# Altium project NEP.PRJPCB
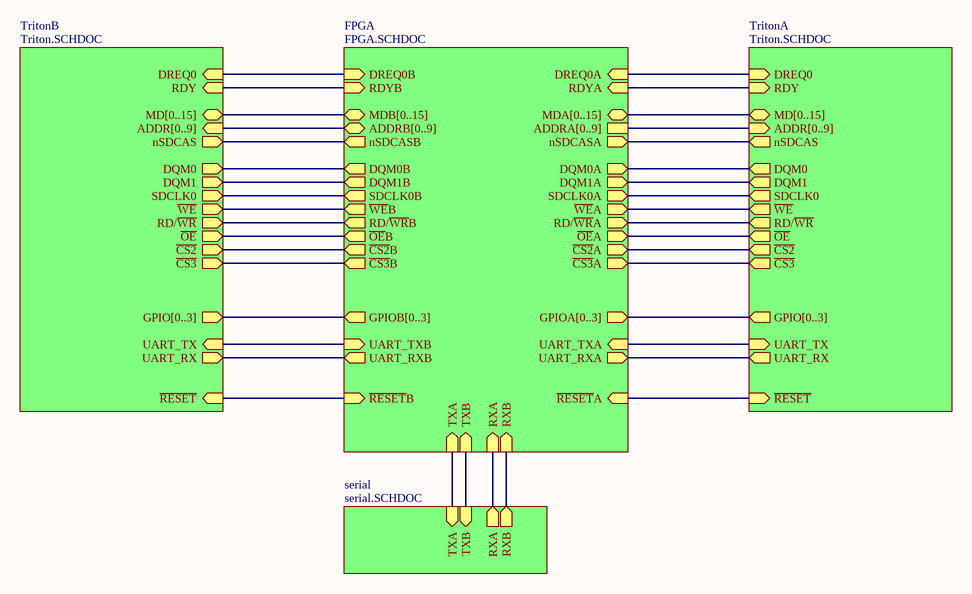
[diagram p0: main.SCHDOC]
5 sheets, 68 parts. Net scope: hierarchical (ports join the sheet entries above them; power ports are global).
Board file: NEP.PCBDOC
Sheets:
  main.SCHDOC
    FPGA = FPGA.SCHDOC
    TritonA = Triton.SCHDOC
    TritonB = Triton.SCHDOC
    serial = serial.SCHDOC
  powerclocks.SCHDOC

## Sheet main.SCHDOC
size B

### Sub-sheets
FPGA = FPGA.SCHDOC: DQM0A (out), DQM1A (out), SDCLK0A (out), DREQ0A (in), RDYA (in), ~{WE}A (out), RD/~{WR}A (out), ~{OE}A (out), ~{CS2}A (out), ~{CS3}A (out), nSDCASA (out), ADDRA[0..9], MDA[0..15] (bidir), ~{RESET}A (in), GPIOA[0..3] (out), UART_RXA (out), UART_TXA (in), RDYB (in), ~{WE}B (out), RD/~{WR}B (out), ~{OE}B (out), ~{CS2}B (out), ~{CS3}B (out), nSDCASB (out), SDCLK0B (out), DQM0B (out), DQM1B (out), DREQ0B (in), ~{RESET}B (in), GPIOB[0..3] (out), UART_RXB (out), UART_TXB (in), MDB[0..15] (bidir), ADDRB[0..9] (bidir), TXA (in), TXB (in), RXA (in), RXB (in)
serial = serial.SCHDOC: TXA (in), TXB (in), RXA (out), RXB (out)
TritonA = Triton.SCHDOC: ~{RESET} (in), DQM0 (out), DQM1 (out), SDCLK0 (out), DREQ0 (in), RDY (in), ~{WE} (out), RD/~{WR} (out), ~{OE} (out), ~{CS2} (out), ~{CS3} (out), nSDCAS (out), GPIO[0..3] (out), UART_RX (out), UART_TX (in), MD[0..15] (bidir), ADDR[0..9] (in)
TritonB = Triton.SCHDOC: ~{RESET} (in), DQM0 (out), DQM1 (out), SDCLK0 (out), DREQ0 (in), RDY (in), ~{WE} (out), RD/~{WR} (out), ~{OE} (out), ~{CS2} (out), ~{CS3} (out), nSDCAS (out), GPIO[0..3] (out), UART_RX (out), UART_TX (in), MD[0..15] (bidir), ADDR[0..9] (in)

### Nets
NetU1_18: sheet FPGA/nSDCASA, sheet TritonA/nSDCAS
NetU1_19: sheet FPGA/~{CS3}A, sheet TritonA/~{CS3}
NetU1_20: sheet FPGA/~{CS2}A, sheet TritonA/~{CS2}
NetU1_21: sheet FPGA/RDYA, sheet TritonA/RDY
NetU1_22: sheet FPGA/~{WE}A, sheet TritonA/~{WE}
NetU1_24: sheet FPGA/RD/~{WR}A, sheet TritonA/RD/~{WR}
NetU1_26: sheet FPGA/~{OE}A, sheet TritonA/~{OE}
NetU1_28: sheet FPGA/RXB, sheet serial/RXB
NetU1_65: sheet FPGA/DREQ0A, sheet TritonA/DREQ0
NetU1_67: sheet FPGA/UART_RXA, sheet TritonA/UART_RX
NetU1_68: sheet FPGA/UART_TXA, sheet TritonA/UART_TX
NetU1_71: sheet FPGA/~{RESET}A, sheet TritonA/~{RESET}
NetU1_72: sheet FPGA/DQM1A, sheet TritonA/DQM1
NetU1_74: sheet FPGA/DQM0A, sheet TritonA/DQM0
NetU1_76: sheet FPGA/TXB, sheet serial/TXB
NetU1_77: sheet FPGA/SDCLK0A, sheet TritonA/SDCLK0
NetU1_78: sheet FPGA/RXA, sheet serial/RXA
NetU1_79: sheet FPGA/TXA, sheet serial/TXA
NetU1_80: sheet FPGA/SDCLK0B, sheet TritonB/SDCLK0
NetU1_102: sheet FPGA/nSDCASB, sheet TritonB/nSDCAS
NetU1_108: sheet FPGA/~{CS2}B, sheet TritonB/~{CS2}
NetU1_109: sheet FPGA/~{CS3}B, sheet TritonB/~{CS3}
NetU1_111: sheet FPGA/~{OE}B, sheet TritonB/~{OE}
NetU1_113: sheet FPGA/RD/~{WR}B, sheet TritonB/RD/~{WR}
NetU1_114: sheet FPGA/~{WE}B, sheet TritonB/~{WE}
NetU1_115: sheet FPGA/RDYB, sheet TritonB/RDY
NetU1_143: sheet FPGA/DREQ0B, sheet TritonB/DREQ0
NetU1_144: sheet FPGA/UART_TXB, sheet TritonB/UART_TX
NetU1_146: sheet FPGA/UART_RXB, sheet TritonB/UART_RX
NetU1_147: sheet FPGA/~{RESET}B, sheet TritonB/~{RESET}
NetU1_148: sheet FPGA/DQM1B, sheet TritonB/DQM1
NetU1_149: sheet FPGA/DQM0B, sheet TritonB/DQM0

### Buses and harness runs
bus sheet FPGA/ADDRA[0..9] = sheet TritonA/ADDR[0..9]
bus sheet FPGA/ADDRB[0..9] = sheet TritonB/ADDR[0..9]
bus sheet FPGA/GPIOA[0..3] = sheet TritonA/GPIO[0..3]
bus sheet FPGA/GPIOB[0..3] = sheet TritonB/GPIO[0..3]
bus sheet FPGA/MDA[0..15] = sheet TritonA/MD[0..15]
bus sheet FPGA/MDB[0..15] = sheet TritonB/MD[0..15]

## Sheet FPGA.SCHDOC
size B
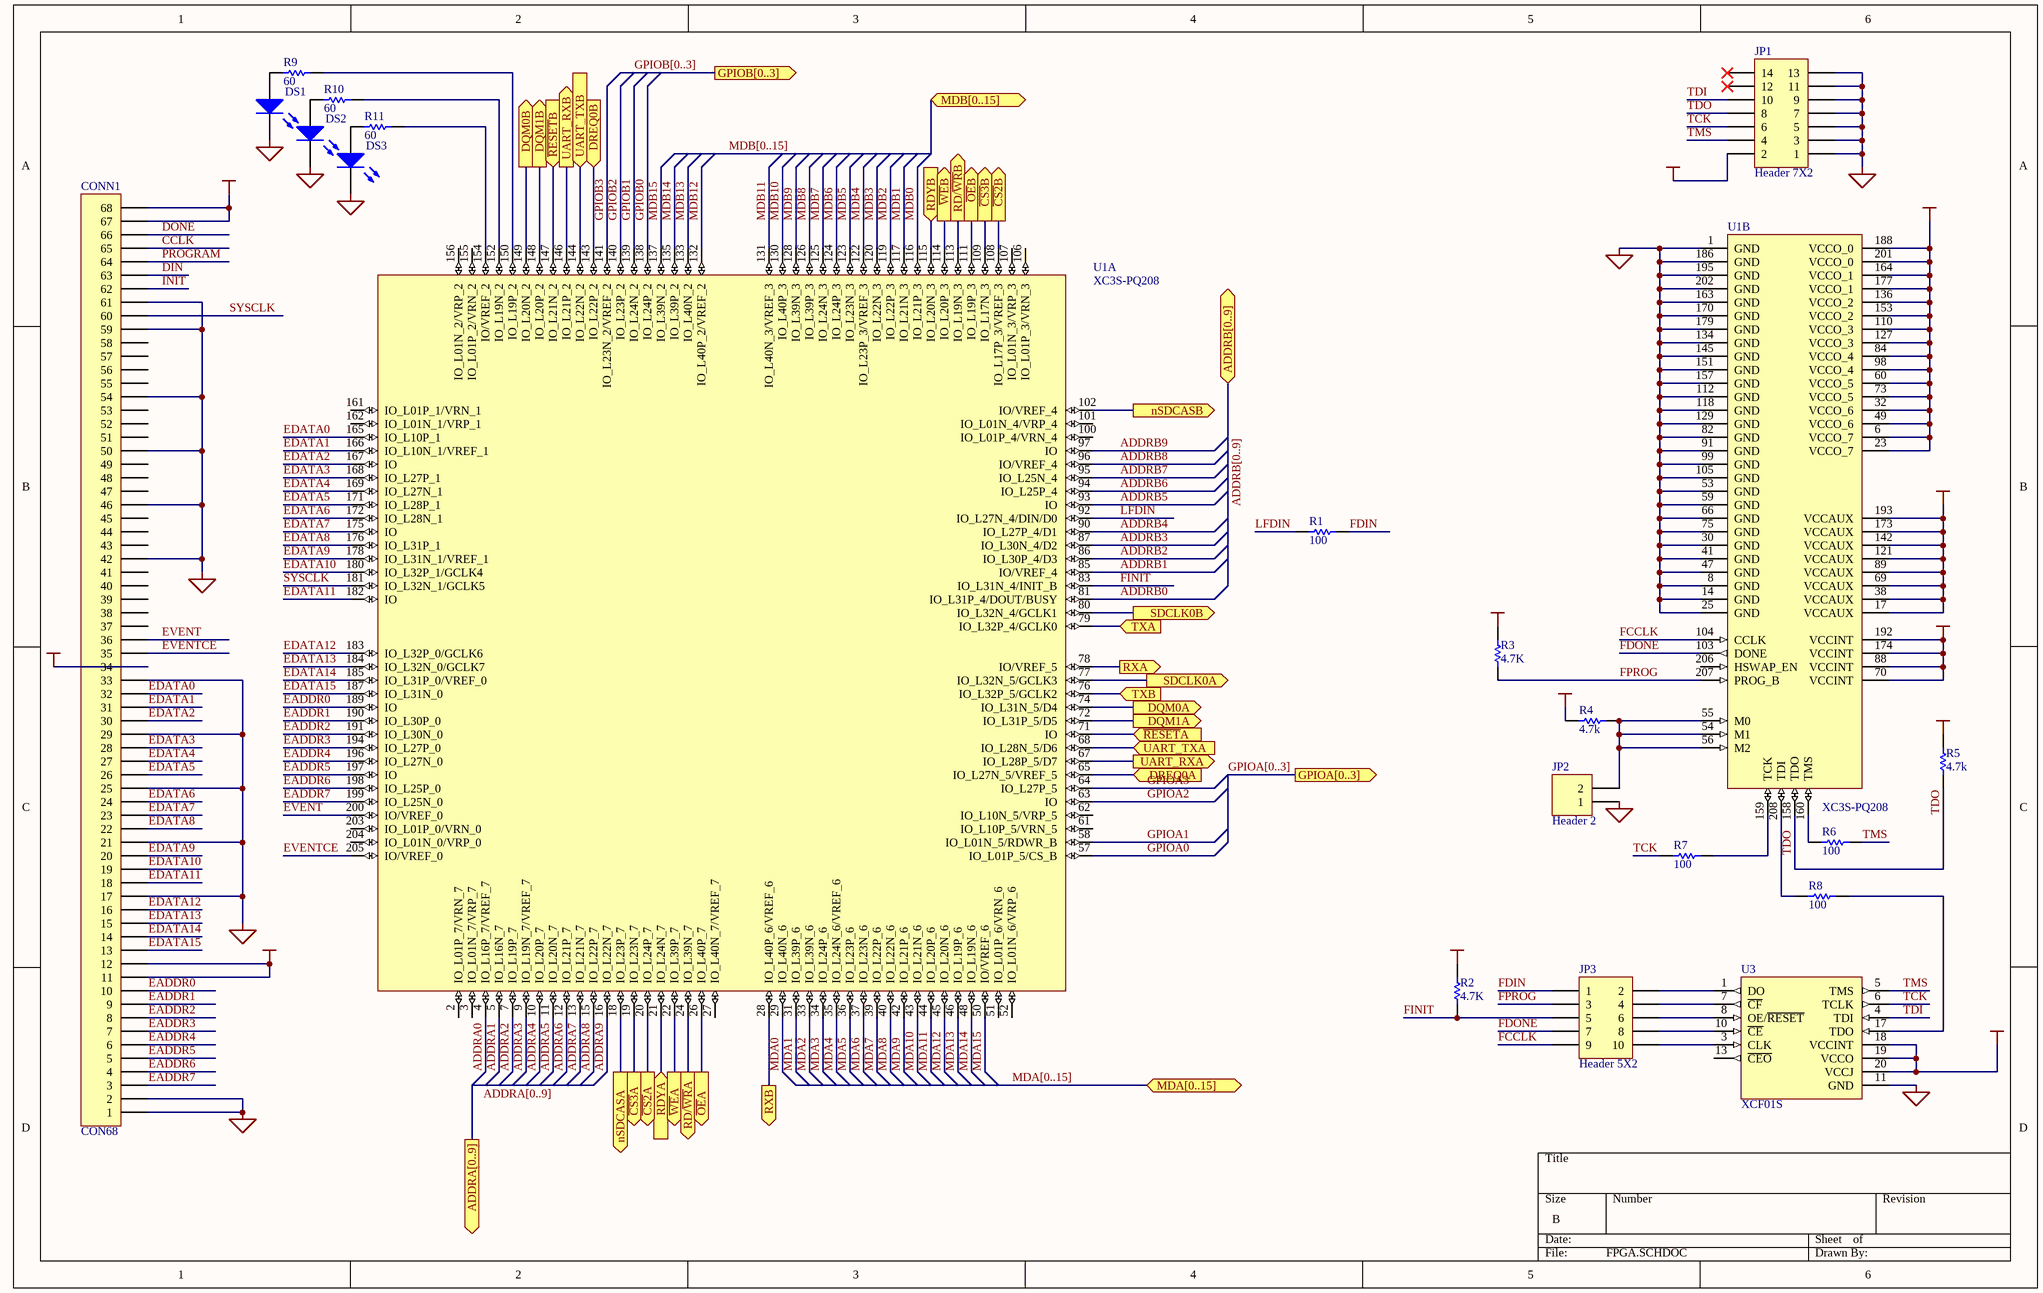
[diagram p1: FPGA.SCHDOC]

### Parts
(Parts that share a designator on the sheet are numbered #1, #2 ... from top to bottom, then left to right.)
CONN1  CON68  [MOLEX 15922068]
DS1  LED0  [T-1_LED]  (value not drawn)
DS2  LED0  [T-1_LED]  (value not drawn)
DS3  LED0  [T-1_LED]  (value not drawn)
JP1  Header 7X2  [HDR2x7-2mm]
JP2  Header 2  [HDR1X2]
JP3  Header 5X2  [HDR2X5]
R1  value 100  [CC1608-0603]  (hidden comment: Res1)
R2  value 4.7K  [CC1608-0603]  (hidden comment: Res1)
R3  value 4.7K  [CC1608-0603]  (hidden comment: Res1)
R4  value 4.7k  [CC1608-0603]  (hidden comment: Res1)
R5  value 4.7k  [CC1608-0603]  (hidden comment: Res1)
R6  value 100  [CC1608-0603]  (hidden comment: Res1)
R7  value 100  [CC1608-0603]  (hidden comment: Res1)
R8  value 100  [CC1608-0603]  (hidden comment: Res1)
R9  value 60  [CC1608-0603]  (hidden comment: Res1)
R10  value 60  [CC1608-0603]  (hidden comment: Res1)
R11  value 60  [CC1608-0603]  (hidden comment: Res1)
U1  XC3S-PQ208  [F-QFP28X28-G208/Z32N]  (parts A,B of 2)
U3#1  XCF01S  [TSSO6x6-G20/X.3]

### Ports
ADDRA[0..9], ADDRB[0..9] (bidir), DQM0A (out), DQM0B (out), DQM1A (out), DQM1B (out), DREQ0A (in), DREQ0B (in), GPIOA[0..3] (out), GPIOB[0..3] (out), MDA[0..15] (bidir), MDB[0..15] (bidir), nSDCASA (out), nSDCASB (out), RD/~{WR}A (out), RD/~{WR}B (out), RDYA (in), RDYB (in), RXA (out), RXB (out), SDCLK0A (out), SDCLK0B (out), TXA (in), TXB (in), UART_RXA (out), UART_RXB (out), UART_TXA (in), UART_TXB (in), ~{CS2}A (out), ~{CS2}B (out), ~{CS3}A (out), ~{CS3}B (out), ~{OE}A (out), ~{OE}B (out), ~{RESET}A (in), ~{RESET}B (in), ~{WE}A (out), ~{WE}B (out)

### Nets
+1.2VCC: U1.70(VCCINT) U1.88(VCCINT) U1.174(VCCINT) U1.192(VCCINT)
+2.5VCC: U1.17(VCCAUX) U1.38(VCCAUX) U1.69(VCCAUX) U1.89(VCCAUX) U1.121(VCCAUX) U1.142(VCCAUX) U1.173(VCCAUX) U1.193(VCCAUX)
+5VCC: CONN1.34
GND: CONN1.1 CONN1.2 CONN1.17 CONN1.21 CONN1.25 CONN1.29 CONN1.33 CONN1.42 CONN1.46 CONN1.50 CONN1.54 CONN1.59 CONN1.61 DS1.2(K) DS2.2(K) DS3.2(K) JP1.1 JP1.3 JP1.5 JP1.7 JP1.9 JP1.11 JP1.13 JP2.1 U1.1(GND) U1.8(GND) U1.14(GND) U1.25(GND) U1.30(GND) U1.41(GND) U1.47(GND) U1.53(GND) U1.59(GND) U1.66(GND) U1.75(GND) U1.82(GND) U1.91(GND) U1.99(GND) U1.105(GND) U1.112(GND) U1.118(GND) U1.129(GND) U1.134(GND) U1.145(GND) U1.151(GND) U1.157(GND) U1.163(GND) U1.170(GND) U1.179(GND) U1.186(GND) U1.195(GND) U1.202(GND) U3#1.11(GND)
VCC: CONN1.11 CONN1.12 CONN1.67 CONN1.68 JP1.2 R2.2 R3.2 R4.1 R5.2 U1.6(VCCO_7) U1.23(VCCO_7) U1.32(VCCO_6) U1.49(VCCO_6) U1.60(VCCO_5) U1.73(VCCO_5) U1.84(VCCO_4) U1.98(VCCO_4) U1.110(VCCO_3) U1.127(VCCO_3) U1.136(VCCO_2) U1.153(VCCO_2) U1.164(VCCO_1) U1.177(VCCO_1) U1.188(VCCO_0) U1.201(VCCO_0) U3#1.18(VCCINT) U3#1.19(VCCO) U3#1.20(VCCJ)
ADDRA0: U1.4(IO_L16P_7/VREF_7)  [project net ADDR0]
ADDRA1: U1.5(IO_L16N_7)  [project net ADDR1]
ADDRA2: U1.7(IO_L19P_7)  [project net ADDR2]
ADDRA3: U1.9(IO_L19N_7/VREF_7)  [project net ADDR3]
ADDRA4: U1.10(IO_L20P_7)  [project net ADDR4]
ADDRA5: U1.11(IO_L20N_7)  [project net ADDR5]
ADDRA6: U1.12(IO_L21P_7)  [project net ADDR6]
ADDRA7: U1.13(IO_L21N_7)  [project net ADDR7]
ADDRA8: U1.15(IO_L22P_7)  [project net ADDR8]
ADDRA9: U1.16(IO_L22N_7)  [project net ADDR9]
ADDRB0: U1.81(IO_L31P_4/DOUT/BUSY)  [project net ADDR0]
ADDRB1: U1.85(IO/VREF_4)  [project net ADDR1]
ADDRB2: U1.86(IO_L30P_4/D3)  [project net ADDR2]
ADDRB3: U1.87(IO_L30N_4/D2)  [project net ADDR3]
ADDRB4: U1.90(IO_L27P_4/D1)  [project net ADDR4]
ADDRB5: U1.93(IO)  [project net ADDR5]
ADDRB6: U1.94(IO_L25P_4)  [project net ADDR6]
ADDRB7: U1.95(IO_L25N_4)  [project net ADDR7]
ADDRB8: U1.96(IO/VREF_4)  [project net ADDR8]
ADDRB9: U1.97(IO)  [project net ADDR9]
CCLK: CONN1.65
DIN: CONN1.63
DONE: CONN1.66
EADDR0: CONN1.10 U1.189(IO)
EADDR1: CONN1.9 U1.190(IO_L30P_0)
EADDR2: CONN1.8 U1.191(IO_L30N_0)
EADDR3: CONN1.7 U1.194(IO_L27P_0)
EADDR4: CONN1.6 U1.196(IO_L27N_0)
EADDR5: CONN1.5 U1.197(IO)
EADDR6: CONN1.4 U1.198(IO_L25P_0)
EADDR7: CONN1.3 U1.199(IO_L25N_0)
EDATA0: CONN1.32 U1.165(IO_L10P_1)
EDATA1: CONN1.31 U1.166(IO_L10N_1/VREF_1)
EDATA2: CONN1.30 U1.167(IO)
EDATA3: CONN1.28 U1.168(IO_L27P_1)
EDATA4: CONN1.27 U1.169(IO_L27N_1)
EDATA5: CONN1.26 U1.171(IO_L28P_1)
EDATA6: CONN1.24 U1.172(IO_L28N_1)
EDATA7: CONN1.23 U1.175(IO)
EDATA8: CONN1.22 U1.176(IO_L31P_1)
EDATA9: CONN1.20 U1.178(IO_L31N_1/VREF_1)
EDATA10: CONN1.19 U1.180(IO_L32P_1/GCLK4)
EDATA11: CONN1.18 U1.182(IO)
EDATA12: CONN1.16 U1.183(IO_L32P_0/GCLK6)
EDATA13: CONN1.15 U1.184(IO_L32N_0/GCLK7)
EDATA14: CONN1.14 U1.185(IO_L31P_0/VREF_0)
EDATA15: CONN1.13 U1.187(IO_L31N_0)
EVENT: CONN1.36 U1.200(IO/VREF_0)
EVENTCE: CONN1.35 U1.205(IO/VREF_0)
FCCLK: JP3.9 U1.104(CCLK)
FDIN: JP3.1 R1.2
FDONE: JP3.7 U1.103(DONE)
FINIT: JP3.5 R2.1 U1.83(IO_L31N_4/INIT_B)
FPROG: JP3.3 R3.1 U1.207(PROG_B)
GPIOA0: U1.57(IO_L01P_5/CS_B)  [project net GPIO0]
GPIOA1: U1.58(IO_L01N_5/RDWR_B)  [project net GPIO1]
GPIOA2: U1.63(IO)  [project net GPIO2]
GPIOA3: U1.64(IO_L27P_5)  [project net GPIO3]
GPIOB0: U1.138(IO_L24P_2)  [project net GPIO0]
GPIOB1: U1.139(IO_L24N_2)  [project net GPIO1]
GPIOB2: U1.140(IO_L23P_2)  [project net GPIO2]
GPIOB3: U1.141(IO_L23N_2/VREF_2)  [project net GPIO3]
INIT: CONN1.62
LFDIN: R1.1 U1.92(IO_L27N_4/DIN/D0)
MDA0: U1.29(IO_L40N_6)  [project net MD0]
MDA1: U1.31(IO_L39P_6)  [project net MD1]
MDA2: U1.33(IO_L39N_6)  [project net MD2]
MDA3: U1.34(IO_L24P_6)  [project net MD3]
MDA4: U1.35(IO_L24N_6/VREF_6)  [project net MD4]
MDA5: U1.36(IO_L23P_6)  [project net MD5]
MDA6: U1.37(IO_L23N_6)  [project net MD6]
MDA7: U1.39(IO_L22P_6)  [project net MD7]
MDA8: U1.40(IO_L22N_6)  [project net MD8]
MDA9: U1.42(IO_L21P_6)  [project net MD9]
MDA10: U1.43(IO_L21N_6)  [project net MD10]
MDA11: U1.44(IO_L20P_6)  [project net MD11]
MDA12: U1.45(IO_L20N_6)  [project net MD12]
MDA13: U1.46(IO_L19P_6)  [project net MD13]
MDA14: U1.48(IO_L19N_6)  [project net MD14]
MDA15: U1.50(IO/VREF_6)  [project net MD15]
MDB0: U1.116(IO_L21P_3)  [project net MD0]
MDB1: U1.117(IO_L21N_3)  [project net MD1]
MDB2: U1.119(IO_L22P_3)  [project net MD2]
MDB3: U1.120(IO_L22N_3)  [project net MD3]
MDB4: U1.122(IO_L23P_3/VREF_3)  [project net MD4]
MDB5: U1.123(IO_L23N_3)  [project net MD5]
MDB6: U1.124(IO_L24P_3)  [project net MD6]
MDB7: U1.125(IO_L24N_3)  [project net MD7]
MDB8: U1.126(IO_L39P_3)  [project net MD8]
MDB9: U1.128(IO_L39N_3)  [project net MD9]
MDB10: U1.130(IO_L40P_3)  [project net MD10]
MDB11: U1.131(IO_L40N_3/VREF_3)  [project net MD11]
MDB12: U1.132(IO_L40P_2/VREF_2)  [project net MD12]
MDB13: U1.133(IO_L40N_2)  [project net MD13]
MDB14: U1.135(IO_L39P_2)  [project net MD14]
MDB15: U1.137(IO_L39N_2)  [project net MD15]
~{PROGRAM}: CONN1.64
SYSCLK: CONN1.60 U1.181(IO_L32N_1/GCLK5)
TCK: JP1.6 R7.2 U3#1.6(TCLK)
TDI: JP1.10 U3#1.4(TDI)
TDO: JP1.8 R5.1 U1.158(TDO)
TMS: JP1.4 R6.1 U3#1.5(TMS)
NetDS1_1: DS1.1(A) R9.1
NetDS2_1: DS2.1(A) R10.1
NetDS3_1: DS3.1(A) R11.1
NetJP2_2: JP2.2 R4.2 U1.54(M1) U1.55(M0) U1.56(M2)
NetJP3_2: JP3.2 U3#1.1(DO)
NetJP3_4: JP3.4 U3#1.7(~{CF})
NetJP3_6: JP3.6 U3#1.8(OE/~{RESET})
NetJP3_8: JP3.8 U3#1.10(~{CE})
NetJP3_10: JP3.10 U3#1.3(CLK)
NetR6_2: R6.2 U1.160(TMS)
NetR7_1: R7.1 U1.159(TCK)
NetR8_1: R8.1 U3#1.17(TDO)
NetR8_2: R8.2 U1.208(TDI)
NetR9_2: R9.2 U1.150(IO_L19P_2)
NetR10_2: R10.2 U1.152(IO_L19N_2)
NetR11_2: R11.2 U1.154(IO/VREF_2)
NetU1_18: U1.18(IO_L23P_7) ; port nSDCASA
NetU1_19: U1.19(IO_L23N_7) ; port ~{CS3}A
NetU1_20: U1.20(IO_L24P_7) ; port ~{CS2}A
NetU1_21: U1.21(IO_L24N_7) ; port RDYA
NetU1_22: U1.22(IO_L39P_7) ; port ~{WE}A
NetU1_24: U1.24(IO_L39N_7) ; port RD/~{WR}A
NetU1_26: U1.26(IO_L40P_7) ; port ~{OE}A
NetU1_28: U1.28(IO_L40P_6/VREF_6) ; port RXB
NetU1_65: U1.65(IO_L27N_5/VREF_5) ; port DREQ0A
NetU1_67: U1.67(IO_L28P_5/D7) ; port UART_RXA
NetU1_68: U1.68(IO_L28N_5/D6) ; port UART_TXA
NetU1_71: U1.71(IO) ; port ~{RESET}A
NetU1_72: U1.72(IO_L31P_5/D5) ; port DQM1A
NetU1_74: U1.74(IO_L31N_5/D4) ; port DQM0A
NetU1_76: U1.76(IO_L32P_5/GCLK2) ; port TXB
NetU1_77: U1.77(IO_L32N_5/GCLK3) ; port SDCLK0A
NetU1_78: U1.78(IO/VREF_5) ; port RXA
NetU1_79: U1.79(IO_L32P_4/GCLK0) ; port TXA
NetU1_80: U1.80(IO_L32N_4/GCLK1) ; port SDCLK0B
NetU1_102: U1.102(IO/VREF_4) ; port nSDCASB
NetU1_108: U1.108(IO_L17P_3/VREF_3) ; port ~{CS2}B
NetU1_109: U1.109(IO_L17N_3) ; port ~{CS3}B
NetU1_111: U1.111(IO_L19P_3) ; port ~{OE}B
NetU1_113: U1.113(IO_L19N_3) ; port RD/~{WR}B
NetU1_114: U1.114(IO_L20P_3) ; port ~{WE}B
NetU1_115: U1.115(IO_L20N_3) ; port RDYB
NetU1_143: U1.143(IO_L22P_2) ; port DREQ0B
NetU1_144: U1.144(IO_L22N_2) ; port UART_TXB
NetU1_146: U1.146(IO_L21P_2) ; port UART_RXB
NetU1_147: U1.147(IO_L21N_2) ; port ~{RESET}B
NetU1_148: U1.148(IO_L20P_2) ; port DQM1B
NetU1_149: U1.149(IO_L20N_2) ; port DQM0B

Not connected (* = marked no-connect by the designer): CONN1 37 38 39 40 41 43 44 45 47 48 49 51 52 53 55 56 57 58; JP1 12* 14*; U1 2(IO_L01P_7/VRN_7) 3(IO_L01N_7/VRP_7) 27(IO_L40N_7/VREF_7) 51(IO_L01P_6/VRN_6) 52(IO_L01N_6/VRP_6) 61(IO_L10P_5/VRN_5) 62(IO_L10N_5/VRP_5) 100(IO_L01P_4/VRN_4) 101(IO_L01N_4/VRP_4) 106(IO_L01P_3/VRN_3) 107(IO_L01N_3/VRP_3) 155(IO_L01P_2/VRN_2) 156(IO_L01N_2/VRP_2) 161(IO_L01P_1/VRN_1) 162(IO_L01N_1/VRP_1) 203(IO_L01P_0/VRN_0) 204(IO_L01N_0/VRP_0) 206(HSWAP_EN); U3#1 13(~{CEO})

### Buses and harness runs
bus ADDRA[0..9] = port ADDRA[0..9]
bus ADDRB[0..9] = port ADDRB[0..9]
bus GPIOA[0..3] = port GPIOA[0..3]
bus GPIOB[0..3] = port GPIOB[0..3]
bus MDA[0..15] = port MDA[0..15]
bus MDB[0..15] = port MDB[0..15]

### Library data of the parts
DS1-DS3 = LED0: Typical INFRARED GaAs LED; Manufacturer: Generic Components; Class I: Optoelectronic; Published: 8-Jun-2000; Revision: July-2002: Re-released for DXP Platform.; Publisher: Altium Limited; Class II: LED
JP1 = Header 7X2: Header, 7-Pin, Dual row; Manufacturer: Generic Components; Class I: Connector; Revision: July-2002: Re-released for DXP Platform.; Publisher: Altium Limited
JP2 = Header 2: Header, 2-Pin; Manufacturer: Generic Components; Class I: Connector; Revision: July-2002: Re-released for DXP Platform.; Publisher: Altium Limited
JP3 = Header 5X2: Header, 5-Pin, Dual row; Manufacturer: Generic Components; Class I: Connector; Revision: July-2002: Re-released for DXP Platform.; Publisher: Altium Limited
R1-R11 = Res1: Resistor; Manufacturer: Generic Components; Class I: Passive; Published: 8-Jun-2000; Revision: July-2002: Re-released for DXP Platform.; Publisher: Altium Limited; Class II: Resistor
U1 = XC3S-PQ208: Xilinx Spartan-3 PQ208
U3#1 = XCF01S: Xilinx Platform Flash

## Sheet Triton.SCHDOC
size B
Used 2 times, as channels TritonA, TritonB. Parts and nets are listed once, with the designators drawn on the sheet.
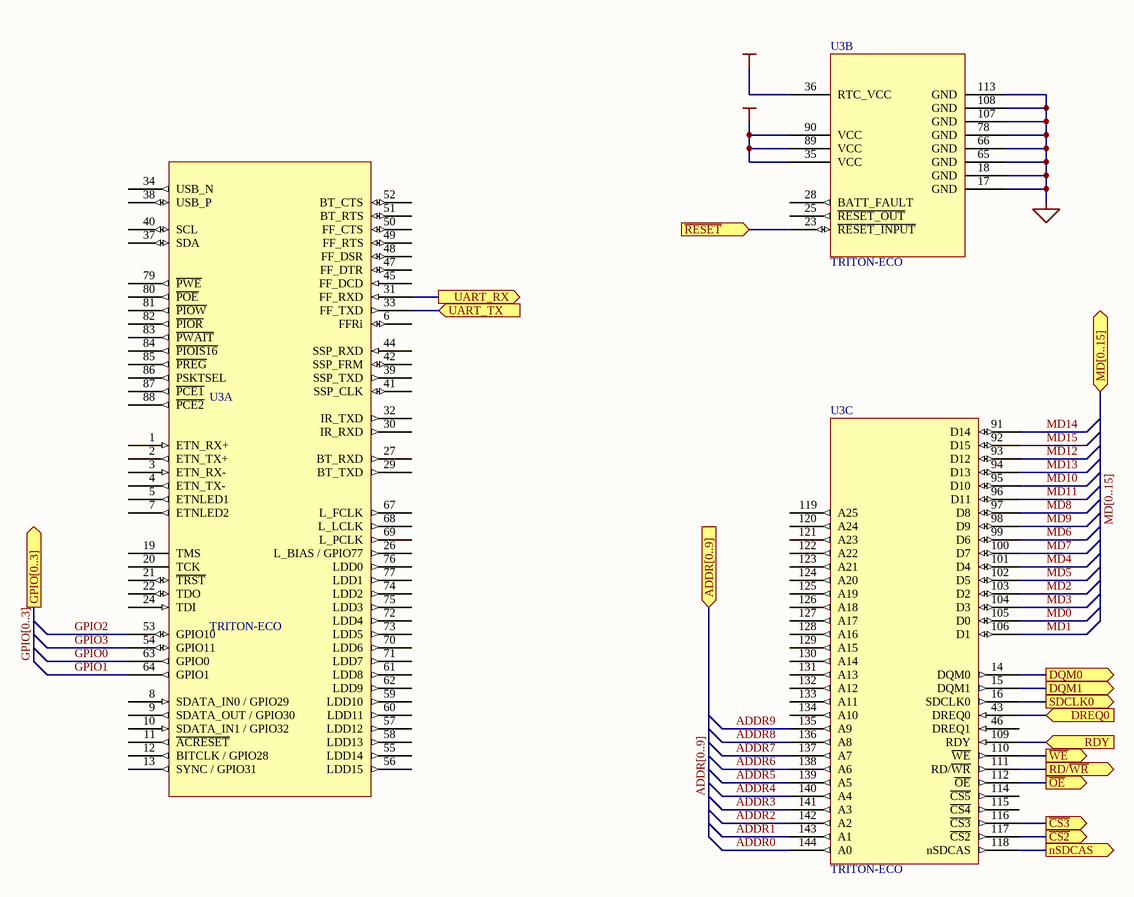
[diagram p2: Triton.SCHDOC]

### Parts
U3  TRITON-ECO  [144-PIN SMT SODIMM]  (parts A,B,C of 3)

### Ports
ADDR[0..9] (in), DQM0 (out), DQM1 (out), DREQ0 (in), GPIO[0..3] (out), MD[0..15] (bidir), nSDCAS (out), RD/~{WR} (out), RDY (in), SDCLK0 (out), UART_RX (out), UART_TX (in), ~{CS2} (out), ~{CS3} (out), ~{OE} (out), ~{RESET} (in), ~{WE} (out)

### Nets
GND: U3.17(GND) U3.18(GND) U3.65(GND) U3.66(GND) U3.78(GND) U3.107(GND) U3.108(GND) U3.113(GND)
VCC: U3.35(VCC) U3.36(RTC_VCC) U3.89(VCC) U3.90(VCC)
ADDR0: U3.144(A0)
ADDR1: U3.143(A1)
ADDR2: U3.142(A2)
ADDR3: U3.141(A3)
ADDR4: U3.140(A4)
ADDR5: U3.139(A5)
ADDR6: U3.138(A6)
ADDR7: U3.137(A7)
ADDR8: U3.136(A8)
ADDR9: U3.135(A9)
~{CS2}: U3.117(~{CS2}) ; port ~{CS2}
~{CS3}: U3.116(~{CS3}) ; port ~{CS3}
DQM0: U3.14(DQM0) ; port DQM0
DQM1: U3.15(DQM1) ; port DQM1
DREQ0: U3.43(DREQ0) ; port DREQ0
GPIO0: U3.63(GPIO0)
GPIO1: U3.64(GPIO1)
GPIO2: U3.53(GPIO10)
GPIO3: U3.54(GPIO11)
MD0: U3.105(D0)
MD1: U3.106(D1)
MD2: U3.103(D2)
MD3: U3.104(D3)
MD4: U3.101(D4)
MD5: U3.102(D5)
MD6: U3.99(D6)
MD7: U3.100(D7)
MD8: U3.97(D8)
MD9: U3.98(D9)
MD10: U3.95(D10)
MD11: U3.96(D11)
MD12: U3.93(D12)
MD13: U3.94(D13)
MD14: U3.91(D14)
MD15: U3.92(D15)
nSDCAS: U3.118(nSDCAS) ; port nSDCAS
~{OE}: U3.112(~{OE}) ; port ~{OE}
~{RESET}: U3.23(~{RESET_INPUT}) ; port ~{RESET}
RD/~{WR}: U3.111(RD/~{WR}) ; port RD/~{WR}
RDY: U3.109(RDY) ; port RDY
SDCLK0: U3.16(SDCLK0) ; port SDCLK0
UART_RX: U3.31(FF_RXD) ; port UART_RX
UART_TX: U3.33(FF_TXD) ; port UART_TX
~{WE}: U3.110(~{WE}) ; port ~{WE}

Not connected (* = marked no-connect by the designer): U3 1(ETN_RX+) 2(ETN_TX+) 3(ETN_RX-) 4(ETN_TX-) 5(ETNLED1) 6(FFRi) 7(ETNLED2) 8(SDATA_IN0_/_GPIO29) 9(SDATA_OUT_/_GPIO30) 10(SDATA_IN1_/_GPIO32) 11(~{ACRESET}) 12(BITCLK_/_GPIO28) 13(SYNC_/_GPIO31) 19(TMS) 20(TCK) 21(~{TRST}) 22(TDO) 24(TDI) 25(~{RESET_OUT}) 26(L_BIAS_/_GPIO77) 27(BT_RXD) 28(BATT_FAULT) 29(BT_TXD) 30(IR_RXD) 32(IR_TXD) 34(USB_N) 37(SDA) 38(USB_P) 39(SSP_TXD) 40(SCL) 41(SSP_CLK) 42(SSP_FRM) 44(SSP_RXD) 45(FF_DCD) 46(DREQ1) 47(FF_DTR) 48(FF_DSR) 49(FF_RTS) 50(FF_CTS) 51(BT_RTS) 52(BT_CTS) 55(LDD14) 56(LDD15) 57(LDD12) 58(LDD13) 59(LDD10) 60(LDD11) 61(LDD8) 62(LDD9) 67(L_FCLK) 68(L_LCLK) 69(L_PCLK) 70(LDD6) 71(LDD7) 72(LDD4) 73(LDD5) 74(LDD2) 75(LDD3) 76(LDD0) 77(LDD1) 79(~{PWE}) 80(~{POE}) 81(~{PIOW}) 82(~{PIOR}) 83(~{PWAIT}) 84(~{PIOIS16}) 85(~{PREG}) 86(PSKTSEL) 87(~{PCE1}) 88(~{PCE2}) 114(~{CS5}) 115(~{CS4}) 119(A25) 120(A24) 121(A23) 122(A22) 123(A21) 124(A20) 125(A19) 126(A18) 127(A17) 128(A16) 129(A15) 130(A14) 131(A13) 132(A12) 133(A11) 134(A10)

### Channels
TritonA: designators end in #2; ports DQM0=NetU1_74 DQM1=NetU1_72 DREQ0=NetU1_65 nSDCAS=NetU1_18 RD/~{WR}=NetU1_24 RDY=NetU1_21 SDCLK0=NetU1_77 UART_RX=NetU1_67 UART_TX=NetU1_68 ~{CS2}=NetU1_20 ~{CS3}=NetU1_19 ~{OE}=NetU1_26 ~{RESET}=NetU1_71 ~{WE}=NetU1_22
TritonB: designators end in _TritonB; ports DQM0=NetU1_149 DQM1=NetU1_148 DREQ0=NetU1_143 nSDCAS=NetU1_102 RD/~{WR}=NetU1_113 RDY=NetU1_115 SDCLK0=NetU1_80 UART_RX=NetU1_146 UART_TX=NetU1_144 ~{CS2}=NetU1_108 ~{CS3}=NetU1_109 ~{OE}=NetU1_111 ~{RESET}=NetU1_147 ~{WE}=NetU1_114

### Buses and harness runs
bus ADDR[0..9] = port ADDR[0..9]
bus GPIO[0..3] = port GPIO[0..3]
bus MD[0..15] = port MD[0..15]

### Library data of the parts
U3 = TRITON_ECO: Triton-ECO 400 MHz XScale DIMM

## Sheet serial.SCHDOC
size B
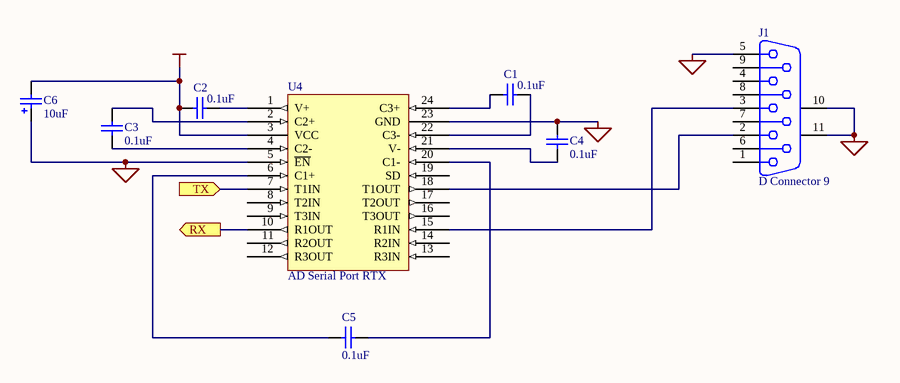
[diagram p3: serial.SCHDOC]

### Parts
(Parts that share a designator on the sheet are numbered #1, #2 ... from top to bottom, then left to right.)
C1#1  value 0.1uF  [CC1608-0603]  (hidden comment: Cap)
C2#1  value 0.1uF  [CC1608-0603]  (hidden comment: Cap)
C3#1  value 0.1uF  [CC1608-0603]  (hidden comment: Cap)
C4#1  value 0.1uF  [CC1608-0603]  (hidden comment: Cap)
C5#1  value 0.1uF  [CC1608-0603]  (hidden comment: Cap)
C6#1  value 10uF  [TC7360-2924]  (hidden comment: Cap Pol1)
J1  D Connector 9  [DSUB1.385-2H9]
U4#1  AD Serial Port RTX  [SSO-G24]

### Ports
RX (out), TX (in)

### Nets
GND: C4#1.2 C6#1.1 J1.5 J1.10(MH1) J1.11(MH2) U4#1.5(~{EN}) U4#1.23(GND)
VCC: C2#1.2 C6#1.2 U4#1.3(VCC)
NetC1#1_1: C1#1.1 U4#1.22(C3-)
NetC1#1_2: C1#1.2 U4#1.24(C3+)
NetC2#1_1: C2#1.1 U4#1.1(V+)
NetC3#1_1: C3#1.1 U4#1.4(C2-)
NetC3#1_2: C3#1.2 U4#1.2(C2+)
NetC4#1_1: C4#1.1 U4#1.21(V-)
NetC5#1_1: C5#1.1 U4#1.20(C1-)
NetC5#1_2: C5#1.2 U4#1.6(C1+)
NetJ1_2: J1.2 U4#1.18(T1OUT)
NetJ1_3: J1.3 U4#1.15(R1IN)
NetU4#1_7: U4#1.7(T1IN) ; port TX
NetU4#1_10: U4#1.10(R1OUT) ; port RX

Not connected (* = marked no-connect by the designer): J1 1 4 6 7 8 9; U4#1 8(T2IN) 9(T3IN) 11(R2OUT) 12(R3OUT) 13(R3IN) 14(R2IN) 16(T3OUT) 17(T2OUT) 19(SD)

### Library data of the parts
C1#1 C2#1 C3#1 C4#1 C5#1 = Cap: Capacitor; Manufacturer: Generic Components; Class I: Passive; Published: 8-Jun-2000; Revision: July-2002: Re-released for DXP Platform.; Publisher: Altium Limited; Class II: Capacitor
C6#1 = Cap Pol1: Polarized Capacitor (Radial); Manufacturer: Generic Components; Class I: Passive; Published: 8-Jun-2000; Revision: July-2002: Re-released for DXP Platform.; Publisher: Altium Limited; Class II: Capacitor
J1 = D Connector 9: Receptacle Assembly, 9 Position, Right Angle; Manufacturer: Generic Components; Package Information: Latest Revision: O; Positions: 9; Published: 15-Jun-2001; Revision: July-2002: Re-released for DXP Platform.; Datasheet: (1-Sep-1999); Package Reference: 788750; Publisher: Altium Limited; Class I: Connector; Orientation: Right Angle; Gender: Receptacle
U4#1 = ADM3312E: AD Serial port transceivers

## Sheet powerclocks.SCHDOC
size B
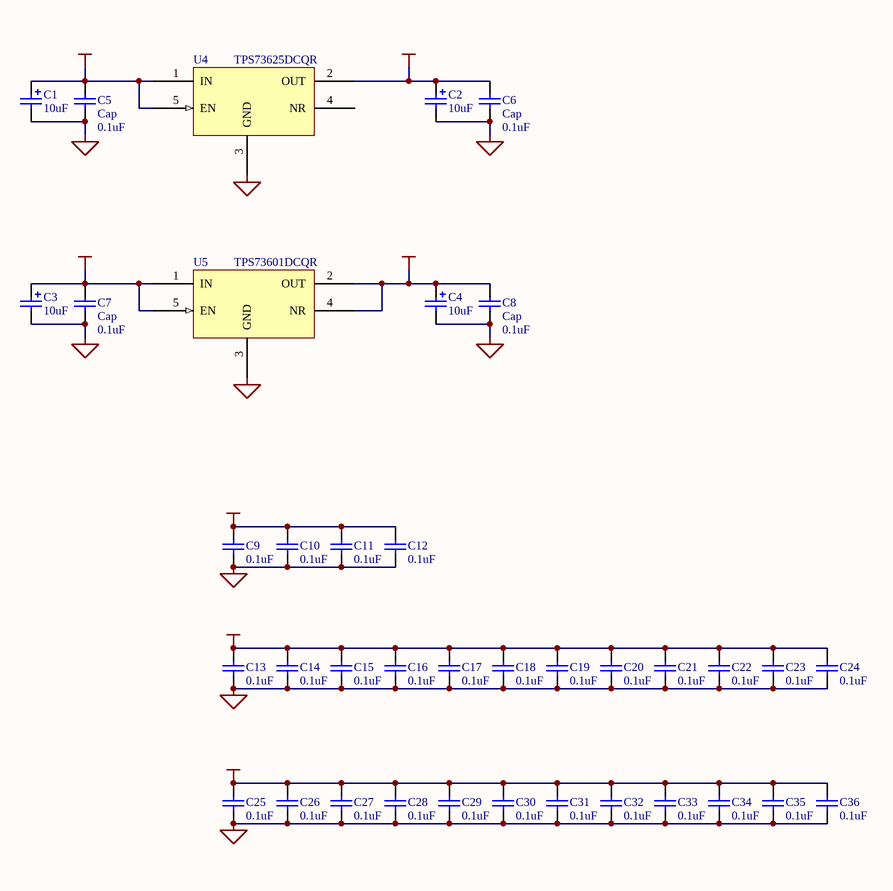
[diagram p4: powerclocks.SCHDOC]

### Parts
(Parts that share a designator on the sheet are numbered #1, #2 ... from top to bottom, then left to right.)
C1#2  value 10uF  [TC7343-2917]  (hidden comment: Cap Pol1)
C2#2  value 10uF  [TC7343-2917]  (hidden comment: Cap Pol1)
C3#2  value 10uF  [TC7343-2917]  (hidden comment: Cap Pol1)
C4#2  value 10uF  [TC7343-2917]  (hidden comment: Cap Pol1)
C5#2  Cap  value 0.1uF  [CC1608-0603]
C6#2  Cap  value 0.1uF  [CC1608-0603]
C7  Cap  value 0.1uF  [CC1608-0603]
C8  Cap  value 0.1uF  [CC1608-0603]
C9  value 0.1uF  [CC1608-0603]  (hidden comment: Cap)
C10  value 0.1uF  [CC1608-0603]  (hidden comment: Cap)
C11  value 0.1uF  [CC1608-0603]  (hidden comment: Cap)
C12  value 0.1uF  [CC1608-0603]  (hidden comment: Cap)
C13  value 0.1uF  [CC1608-0603]  (hidden comment: Cap)
C14  value 0.1uF  [CC1608-0603]  (hidden comment: Cap)
C15  value 0.1uF  [CC1608-0603]  (hidden comment: Cap)
C16  value 0.1uF  [CC1608-0603]  (hidden comment: Cap)
C17  value 0.1uF  [CC1608-0603]  (hidden comment: Cap)
C18  value 0.1uF  [CC1608-0603]  (hidden comment: Cap)
C19  value 0.1uF  [CC1608-0603]  (hidden comment: Cap)
C20  value 0.1uF  [CC1608-0603]  (hidden comment: Cap)
C21  value 0.1uF  [CC1608-0603]  (hidden comment: Cap)
C22  value 0.1uF  [CC1608-0603]  (hidden comment: Cap)
C23  value 0.1uF  [CC1608-0603]  (hidden comment: Cap)
C24  value 0.1uF  [CC1608-0603]  (hidden comment: Cap)
C25  value 0.1uF  [CC1608-0603]  (hidden comment: Cap)
C26  value 0.1uF  [CC1608-0603]  (hidden comment: Cap)
C27  value 0.1uF  [CC1608-0603]  (hidden comment: Cap)
C28  value 0.1uF  [CC1608-0603]  (hidden comment: Cap)
C29  value 0.1uF  [CC1608-0603]  (hidden comment: Cap)
C30  value 0.1uF  [CC1608-0603]  (hidden comment: Cap)
C31  value 0.1uF  [CC1608-0603]  (hidden comment: Cap)
C32  value 0.1uF  [CC1608-0603]  (hidden comment: Cap)
C33  value 0.1uF  [CC1608-0603]  (hidden comment: Cap)
C34  value 0.1uF  [CC1608-0603]  (hidden comment: Cap)
C35  value 0.1uF  [CC1608-0603]  (hidden comment: Cap)
C36  value 0.1uF  [CC1608-0603]  (hidden comment: Cap)
U4#2  TPS73625DCQR  [SOT223-5/Simple]
U5  TPS73601DCQR  [SOT223-5/Simple]

### Nets
+1.2VCC: C4#2.1 C8.2 C9.2 C10.2 C11.2 C12.2 U5.2(OUT) U5.4(NR)
+2.5VCC: C2#2.1 C6#2.2 C13.2 C14.2 C15.2 C16.2 C17.2 C18.2 C19.2 C20.2 C21.2 C22.2 C23.2 C24.2 U4#2.2(OUT)
GND: C1#2.2 C2#2.2 C3#2.2 C4#2.2 C5#2.1 C6#2.1 C7.1 C8.1 C9.1 C10.1 C11.1 C12.1 C13.1 C14.1 C15.1 C16.1 C17.1 C18.1 C19.1 C20.1 C21.1 C22.1 C23.1 C24.1 C25.1 C26.1 C27.1 C28.1 C29.1 C30.1 C31.1 C32.1 C33.1 C34.1 C35.1 C36.1 U4#2.3(GND) U5.3(GND)
VCC: C1#2.1 C3#2.1 C5#2.2 C7.2 C25.2 C26.2 C27.2 C28.2 C29.2 C30.2 C31.2 C32.2 C33.2 C34.2 C35.2 C36.2 U4#2.1(IN) U4#2.5(EN) U5.1(IN) U5.5(EN)

Not connected (* = marked no-connect by the designer): U4#2 4(NR)

### Library data of the parts
C1#2 C2#2 C3#2 C4#2 = Cap Pol1: as C6#1 on sheet serial; Published: 8-Jun-2000; Revision: July-2002: Re-released for DXP Platform.; Publisher: Altium Limited; Class II: Capacitor
C5#2 C6#2 C7-C36 = Cap: as C1#1 on sheet serial; Published: 8-Jun-2000; Revision: July-2002: Re-released for DXP Platform.; Publisher: Altium Limited; Class II: Capacitor
U4#2 U5 = TPS736XX: Cap-free NMOS 400 mA LDO

## Nets that join several sheets
+1.2VCC: FPGA (U1.70 U1.88 U1.174 U1.192), powerclocks (8 pins)
+2.5VCC: FPGA (8 pins), powerclocks (15 pins)
GND: FPGA (53 pins), TritonA (8 pins), TritonB (8 pins), serial (7 pins), powerclocks (38 pins)
VCC: FPGA (28 pins), TritonA (U3#2.35 U3#2.36 U3#2.89 U3#2.90), TritonB (U3_TritonB.35 U3_TritonB.36 U3_TritonB.89 U3_TritonB.90), serial (C2#1.2 C6#1.2 U4#1.3), powerclocks (20 pins)
ADDR0: FPGA (U1.4), TritonA (U3#2.144)
ADDR0: FPGA (U1.81), TritonB (U3_TritonB.144)
ADDR1: FPGA (U1.5), TritonA (U3#2.143)
ADDR1: FPGA (U1.85), TritonB (U3_TritonB.143)
ADDR2: FPGA (U1.7), TritonA (U3#2.142)
ADDR2: FPGA (U1.86), TritonB (U3_TritonB.142)
ADDR3: FPGA (U1.9), TritonA (U3#2.141)
ADDR3: FPGA (U1.87), TritonB (U3_TritonB.141)
ADDR4: FPGA (U1.10), TritonA (U3#2.140)
ADDR4: FPGA (U1.90), TritonB (U3_TritonB.140)
ADDR5: FPGA (U1.11), TritonA (U3#2.139)
ADDR5: FPGA (U1.93), TritonB (U3_TritonB.139)
ADDR6: FPGA (U1.12), TritonA (U3#2.138)
ADDR6: FPGA (U1.94), TritonB (U3_TritonB.138)
ADDR7: FPGA (U1.13), TritonA (U3#2.137)
ADDR7: FPGA (U1.95), TritonB (U3_TritonB.137)
ADDR8: FPGA (U1.15), TritonA (U3#2.136)
ADDR8: FPGA (U1.96), TritonB (U3_TritonB.136)
ADDR9: FPGA (U1.16), TritonA (U3#2.135)
ADDR9: FPGA (U1.97), TritonB (U3_TritonB.135)
GPIO0: FPGA (U1.57), TritonA (U3#2.63)
GPIO0: FPGA (U1.138), TritonB (U3_TritonB.63)
GPIO1: FPGA (U1.58), TritonA (U3#2.64)
GPIO1: FPGA (U1.139), TritonB (U3_TritonB.64)
GPIO2: FPGA (U1.63), TritonA (U3#2.53)
GPIO2: FPGA (U1.140), TritonB (U3_TritonB.53)
GPIO3: FPGA (U1.64), TritonA (U3#2.54)
GPIO3: FPGA (U1.141), TritonB (U3_TritonB.54)
MD0: FPGA (U1.29), TritonA (U3#2.105)
MD0: FPGA (U1.116), TritonB (U3_TritonB.105)
MD1: FPGA (U1.31), TritonA (U3#2.106)
MD1: FPGA (U1.117), TritonB (U3_TritonB.106)
MD2: FPGA (U1.33), TritonA (U3#2.103)
MD2: FPGA (U1.119), TritonB (U3_TritonB.103)
MD3: FPGA (U1.34), TritonA (U3#2.104)
MD3: FPGA (U1.120), TritonB (U3_TritonB.104)
MD4: FPGA (U1.35), TritonA (U3#2.101)
MD4: FPGA (U1.122), TritonB (U3_TritonB.101)
MD5: FPGA (U1.36), TritonA (U3#2.102)
MD5: FPGA (U1.123), TritonB (U3_TritonB.102)
MD6: FPGA (U1.37), TritonA (U3#2.99)
MD6: FPGA (U1.124), TritonB (U3_TritonB.99)
MD7: FPGA (U1.39), TritonA (U3#2.100)
MD7: FPGA (U1.125), TritonB (U3_TritonB.100)
MD8: FPGA (U1.40), TritonA (U3#2.97)
MD8: FPGA (U1.126), TritonB (U3_TritonB.97)
MD9: FPGA (U1.42), TritonA (U3#2.98)
MD9: FPGA (U1.128), TritonB (U3_TritonB.98)
MD10: FPGA (U1.43), TritonA (U3#2.95)
MD10: FPGA (U1.130), TritonB (U3_TritonB.95)
MD11: FPGA (U1.44), TritonA (U3#2.96)
MD11: FPGA (U1.131), TritonB (U3_TritonB.96)
MD12: FPGA (U1.45), TritonA (U3#2.93)
MD12: FPGA (U1.132), TritonB (U3_TritonB.93)
MD13: FPGA (U1.46), TritonA (U3#2.94)
MD13: FPGA (U1.133), TritonB (U3_TritonB.94)
MD14: FPGA (U1.48), TritonA (U3#2.91)
MD14: FPGA (U1.135), TritonB (U3_TritonB.91)
MD15: FPGA (U1.50), TritonA (U3#2.92)
MD15: FPGA (U1.137), TritonB (U3_TritonB.92)
NetU1_18: FPGA (U1.18), TritonA (U3#2.118)
NetU1_19: FPGA (U1.19), TritonA (U3#2.116)
NetU1_20: FPGA (U1.20), TritonA (U3#2.117)
NetU1_21: FPGA (U1.21), TritonA (U3#2.109)
NetU1_22: FPGA (U1.22), TritonA (U3#2.110)
NetU1_24: FPGA (U1.24), TritonA (U3#2.111)
NetU1_26: FPGA (U1.26), TritonA (U3#2.112)
NetU1_65: FPGA (U1.65), TritonA (U3#2.43)
NetU1_67: FPGA (U1.67), TritonA (U3#2.31)
NetU1_68: FPGA (U1.68), TritonA (U3#2.33)
NetU1_71: FPGA (U1.71), TritonA (U3#2.23)
NetU1_72: FPGA (U1.72), TritonA (U3#2.15)
NetU1_74: FPGA (U1.74), TritonA (U3#2.14)
NetU1_77: FPGA (U1.77), TritonA (U3#2.16)
NetU1_80: FPGA (U1.80), TritonB (U3_TritonB.16)
NetU1_102: FPGA (U1.102), TritonB (U3_TritonB.118)
NetU1_108: FPGA (U1.108), TritonB (U3_TritonB.117)
NetU1_109: FPGA (U1.109), TritonB (U3_TritonB.116)
NetU1_111: FPGA (U1.111), TritonB (U3_TritonB.112)
NetU1_113: FPGA (U1.113), TritonB (U3_TritonB.111)
NetU1_114: FPGA (U1.114), TritonB (U3_TritonB.110)
NetU1_115: FPGA (U1.115), TritonB (U3_TritonB.109)
NetU1_143: FPGA (U1.143), TritonB (U3_TritonB.43)
NetU1_144: FPGA (U1.144), TritonB (U3_TritonB.33)
NetU1_146: FPGA (U1.146), TritonB (U3_TritonB.31)
NetU1_147: FPGA (U1.147), TritonB (U3_TritonB.23)
NetU1_148: FPGA (U1.148), TritonB (U3_TritonB.15)
NetU1_149: FPGA (U1.149), TritonB (U3_TritonB.14)